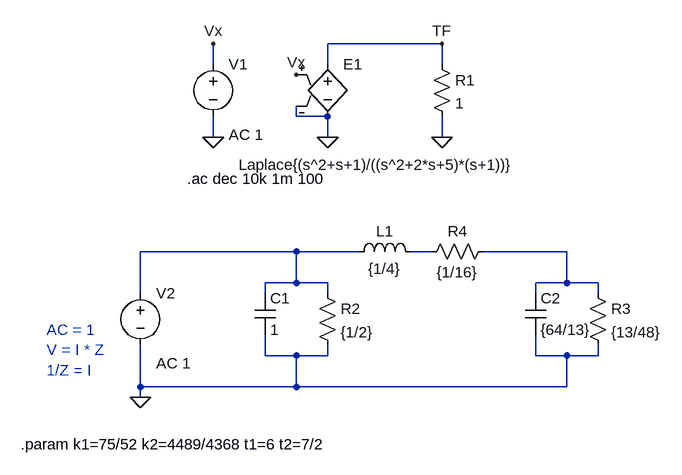
[diagram p0: schematic TS10_3.asc]
TS10_3.asc, the LTspice schematic file:
Version 4
SHEET 1 880 680
WIRE 400 -96 224 -96
WIRE 48 -64 48 -96
WIRE 224 -64 224 -96
WIRE 400 -64 400 -96
WIRE 176 16 176 0
WIRE 224 16 176 16
WIRE 48 48 48 16
WIRE 224 48 224 16
WIRE 400 48 400 16
WIRE 176 224 -64 224
WIRE 272 224 176 224
WIRE 384 224 352 224
WIRE 592 224 464 224
WIRE 176 272 176 224
WIRE 176 272 128 272
WIRE 224 272 176 272
WIRE 592 272 592 224
WIRE 592 272 544 272
WIRE 640 272 592 272
WIRE -64 288 -64 224
WIRE 128 288 128 272
WIRE 224 288 224 272
WIRE 544 288 544 272
WIRE 640 288 640 272
WIRE 128 384 128 352
WIRE 176 384 128 384
WIRE 224 384 224 368
WIRE 224 384 176 384
WIRE 544 384 544 352
WIRE 592 384 544 384
WIRE 640 384 640 368
WIRE 640 384 592 384
WIRE -64 432 -64 368
WIRE 176 432 176 384
WIRE 176 432 -64 432
WIRE 592 432 592 384
WIRE 592 432 176 432
WIRE -64 448 -64 432
FLAG 224 48 0
FLAG 48 48 0
FLAG 48 -96 Vx
FLAG 176 -48 Vx
FLAG 400 48 0
FLAG -64 448 0
FLAG 400 -96 TF
SYMBOL voltage 48 -80 R0
WINDOW 123 24 124 Left 2
WINDOW 39 0 0 Left 0
SYMATTR Value2 AC 1
SYMATTR InstName V1
SYMATTR Value ""
SYMBOL e 224 -80 R0
WINDOW 3 -137 170 Left 2
SYMATTR Value Laplace{(s^2+s+1)/((s^2+2*s+5)*(s+1))}
SYMATTR InstName E1
SYMBOL res 384 -80 R0
SYMATTR InstName R1
SYMATTR Value 1
SYMBOL voltage -64 272 R0
WINDOW 123 24 124 Left 2
WINDOW 39 0 0 Left 0
SYMATTR Value2 AC 1
SYMATTR InstName V2
SYMATTR Value ""
SYMBOL res 208 272 R0
SYMATTR InstName R2
SYMATTR Value {1/2}
SYMBOL cap 112 288 R0
SYMATTR InstName C1
SYMATTR Value 1
SYMBOL res 624 272 R0
SYMATTR InstName R3
SYMATTR Value {13/48}
SYMBOL cap 528 288 R0
SYMATTR InstName C2
SYMATTR Value {64/13}
SYMBOL res 480 208 R90
WINDOW 0 0 56 VBottom 2
WINDOW 3 32 56 VTop 2
SYMATTR InstName R4
SYMATTR Value {1/16}
SYMBOL ind 256 240 R270
WINDOW 0 32 56 VTop 2
WINDOW 3 5 56 VBottom 2
SYMATTR InstName L1
SYMATTR Value {1/4}
TEXT 8 112 Left 2 !.ac dec 10k 1m 100
TEXT -208 344 Left 2 ;AC = 1\nV = I * Z\n1/Z = I
TEXT -248 520 Left 2 !.param k1=75/52 k2=4489/4368 t1=6 t2=7/2

The netlist it stands for:
* TS10_3.asc
V1 Vx 0 AC 1
E1 TF 0 Vx 0 Laplace{(s^2+s+1)/((s^2+2*s+5)*(s+1))}
R1 TF 0 1
V2 N001 0 AC 1
R2 N001 0 {1/2}
C1 N001 0 1
R3 N003 0 {13/48}
C2 N003 0 {64/13}
R4 N003 N002 {1/16}
L1 N001 N002 {1/4}
.ac dec 10k 1m 100
* AC = 1
* V = I * Z
* 1/Z = I
.param k1=75/52 k2=4489/4368 t1=6 t2=7/2
.backanno
.end